# EAGLE design small (EAGLE 5.11)

## Sheet 1 of 3
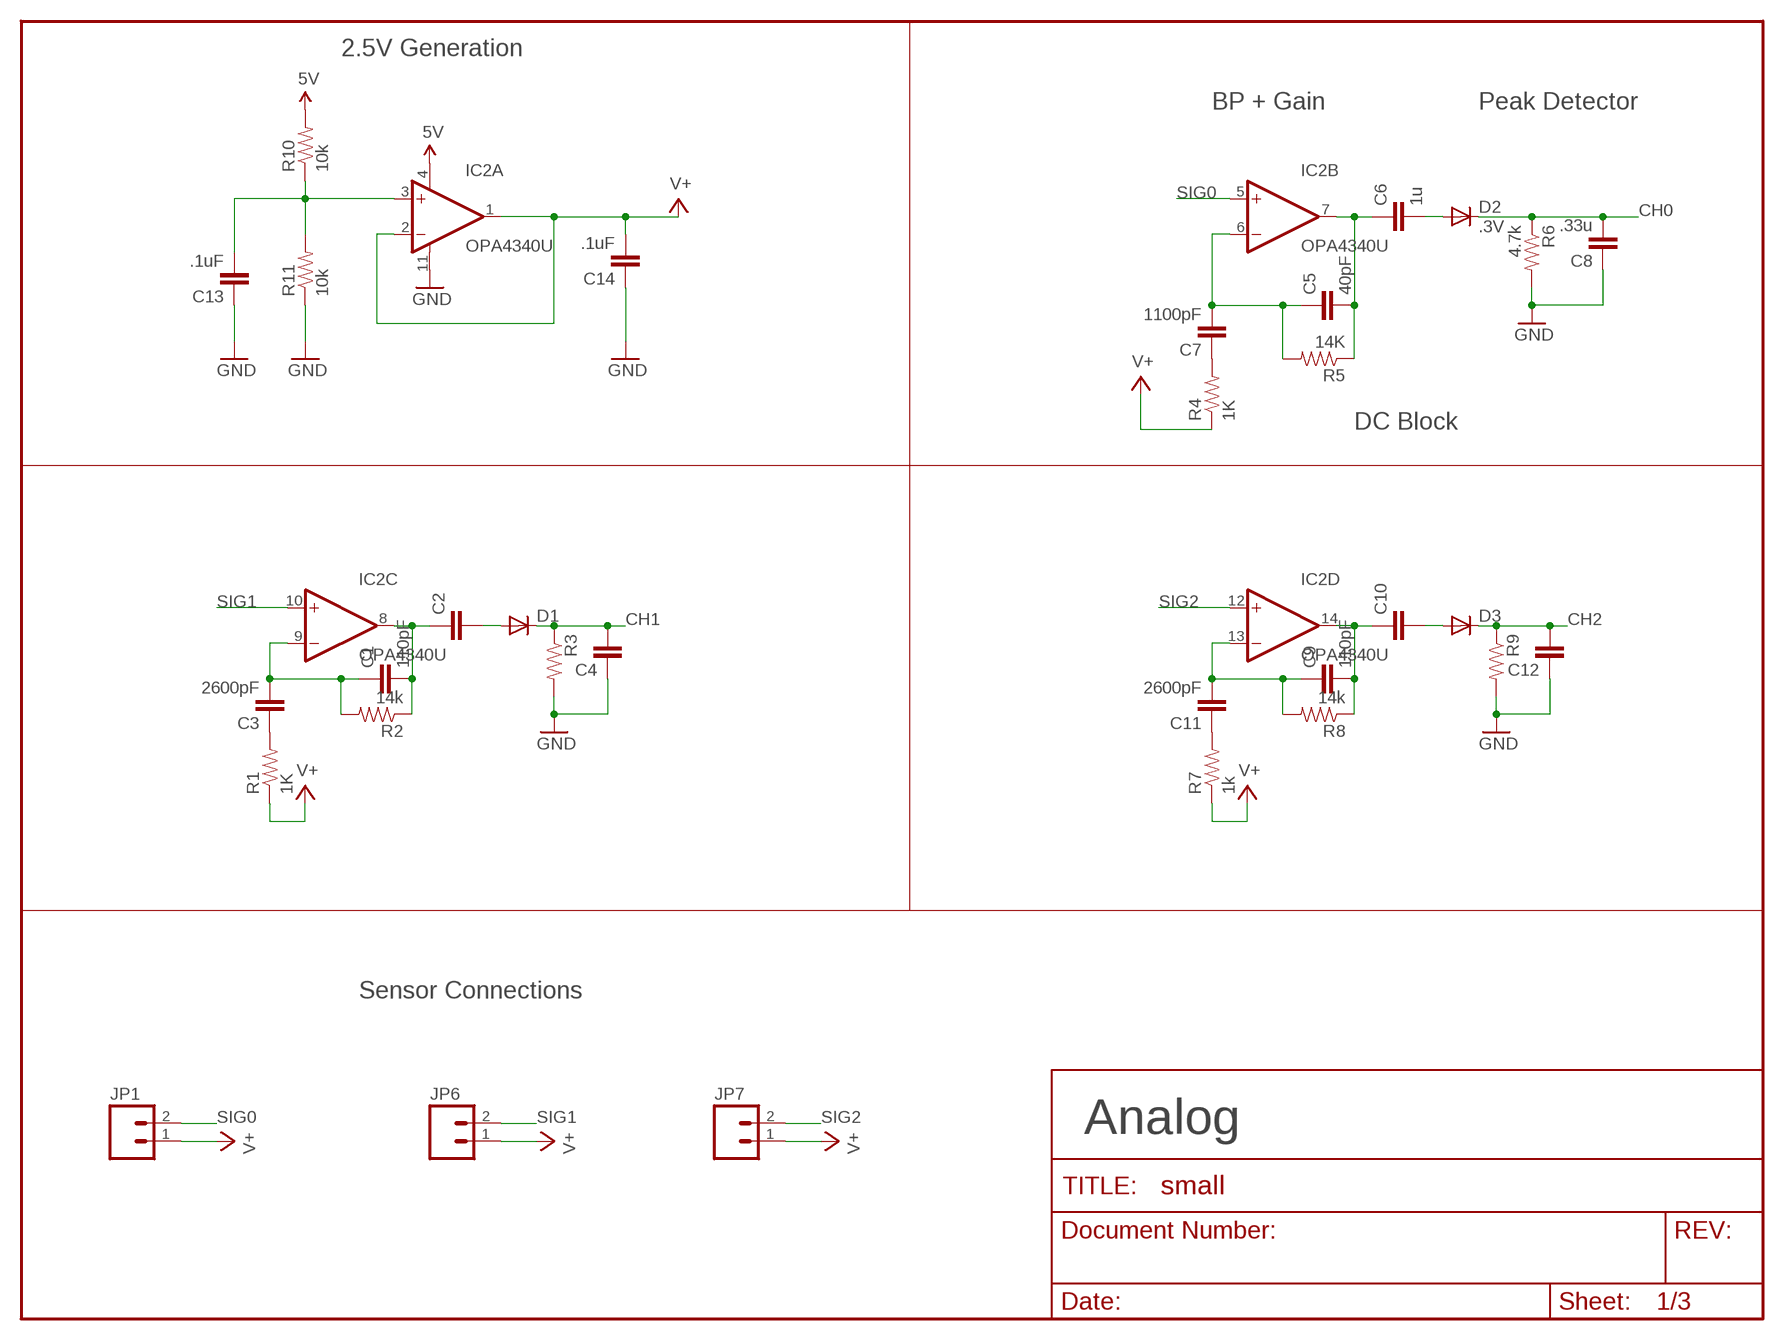
[diagram p0: schematic, sheet 1]

### Parts
C1  110pF  CAP0603-CAP  [0603-CAP]
C2  CAP0603-CAP  [0603-CAP]
C3  2600pF  CAP0603-CAP  [0603-CAP]
C4  CAP0603-CAP  [0603-CAP]
C5  40pF  CAP0603-CAP  [0603-CAP]
C6  1u  CAP0603-CAP  [0603-CAP]
C7  1100pF  CAP0603-CAP  [0603-CAP]
C8  .33u  CAP0603-CAP  [0603-CAP]
C9  110pF  CAP0603-CAP  [0603-CAP]
C10  CAP0603-CAP  [0603-CAP]
C11  2600pF  CAP0603-CAP  [0603-CAP]
C12  CAP0603-CAP  [0603-CAP]
C13  .1uF  CAP0603-CAP  [0603-CAP]
C14  .1uF  CAP0603-CAP  [0603-CAP]
D1  DIODESOD  [SOD-323]
D2  .3V  DIODESOD  [SOD-323]
D3  DIODESOD  [SOD-323]
IC2  OPA4340U  [SO14]
JP1  M02POLAR  [MOLEX-1X2]
JP6  M02POLAR  [MOLEX-1X2]
JP7  M02POLAR  [MOLEX-1X2]
R1  1K  RESISTOR0603-RES  [0603-RES]
R2  14k  RESISTOR0603-RES  [0603-RES]
R3  RESISTOR0603-RES  [0603-RES]
R4  1K  RESISTOR0603-RES  [0603-RES]
R5  14K  RESISTOR0603-RES  [0603-RES]
R6  4.7k  RESISTOR0603-RES  [0603-RES]
R7  1k  RESISTOR0603-RES  [0603-RES]
R8  14k  RESISTOR0603-RES  [0603-RES]
R9  RESISTOR0603-RES  [0603-RES]
R10  10k  RESISTOR0603-RES  [0603-RES]
R11  10k  RESISTOR0603-RES  [0603-RES]

### Nets
5V: IC2.4(A:V+) R10.2 ; also sheet 2,3
CH0: C8.2 D2.1(C) R6.1 ; also sheet 3
CH1: C4.2 D1.1(C) R3.1 ; also sheet 3
CH2: C12.2 D3.1(C) R9.1 ; also sheet 3
GND: C4.1 C8.1 C12.1 C13.1 C14.1 IC2.11(A:V-) R3.2 R6.2 R9.2 R11.1 ; also sheet 2,3
N$1: C2.2 D1.2(A)
N$2: C1.1 C3.2 IC2.9(C:-IN) R2.2
N$3: C3.1 R1.2
N$4: C6.2 D2.2(A)
N$5: C1.2 C2.1 IC2.8(C:OUT) R2.1
N$6: C5.1 C7.2 IC2.6(B:-IN) R5.2
N$8: C7.1 R4.2
N$9: C5.2 C6.1 IC2.7(B:OUT) R5.1
N$11: C10.2 D3.2(A)
N$12: C9.1 C11.2 IC2.13(D:-IN) R8.2
N$13: C11.1 R7.2
N$14: C9.2 C10.1 IC2.14(D:OUT) R8.1
N$17: C13.2 IC2.3(A:+IN) R10.1 R11.2
SIG0: IC2.5(B:+IN) JP1.2
SIG1: IC2.10(C:+IN) JP6.2
SIG2: IC2.12(D:+IN) JP7.2
V+: C14.2 IC2.1(A:OUT) IC2.2(A:-IN) JP1.1 JP6.1 JP7.1 R1.1 R4.1 R7.1 ; also sheet 3

### Notes on the sheet
- 2.5V Generation
- BP + Gain | Peak Detector
- DC Block
- Sensor Connections
- Analog

## Sheet 2 of 3
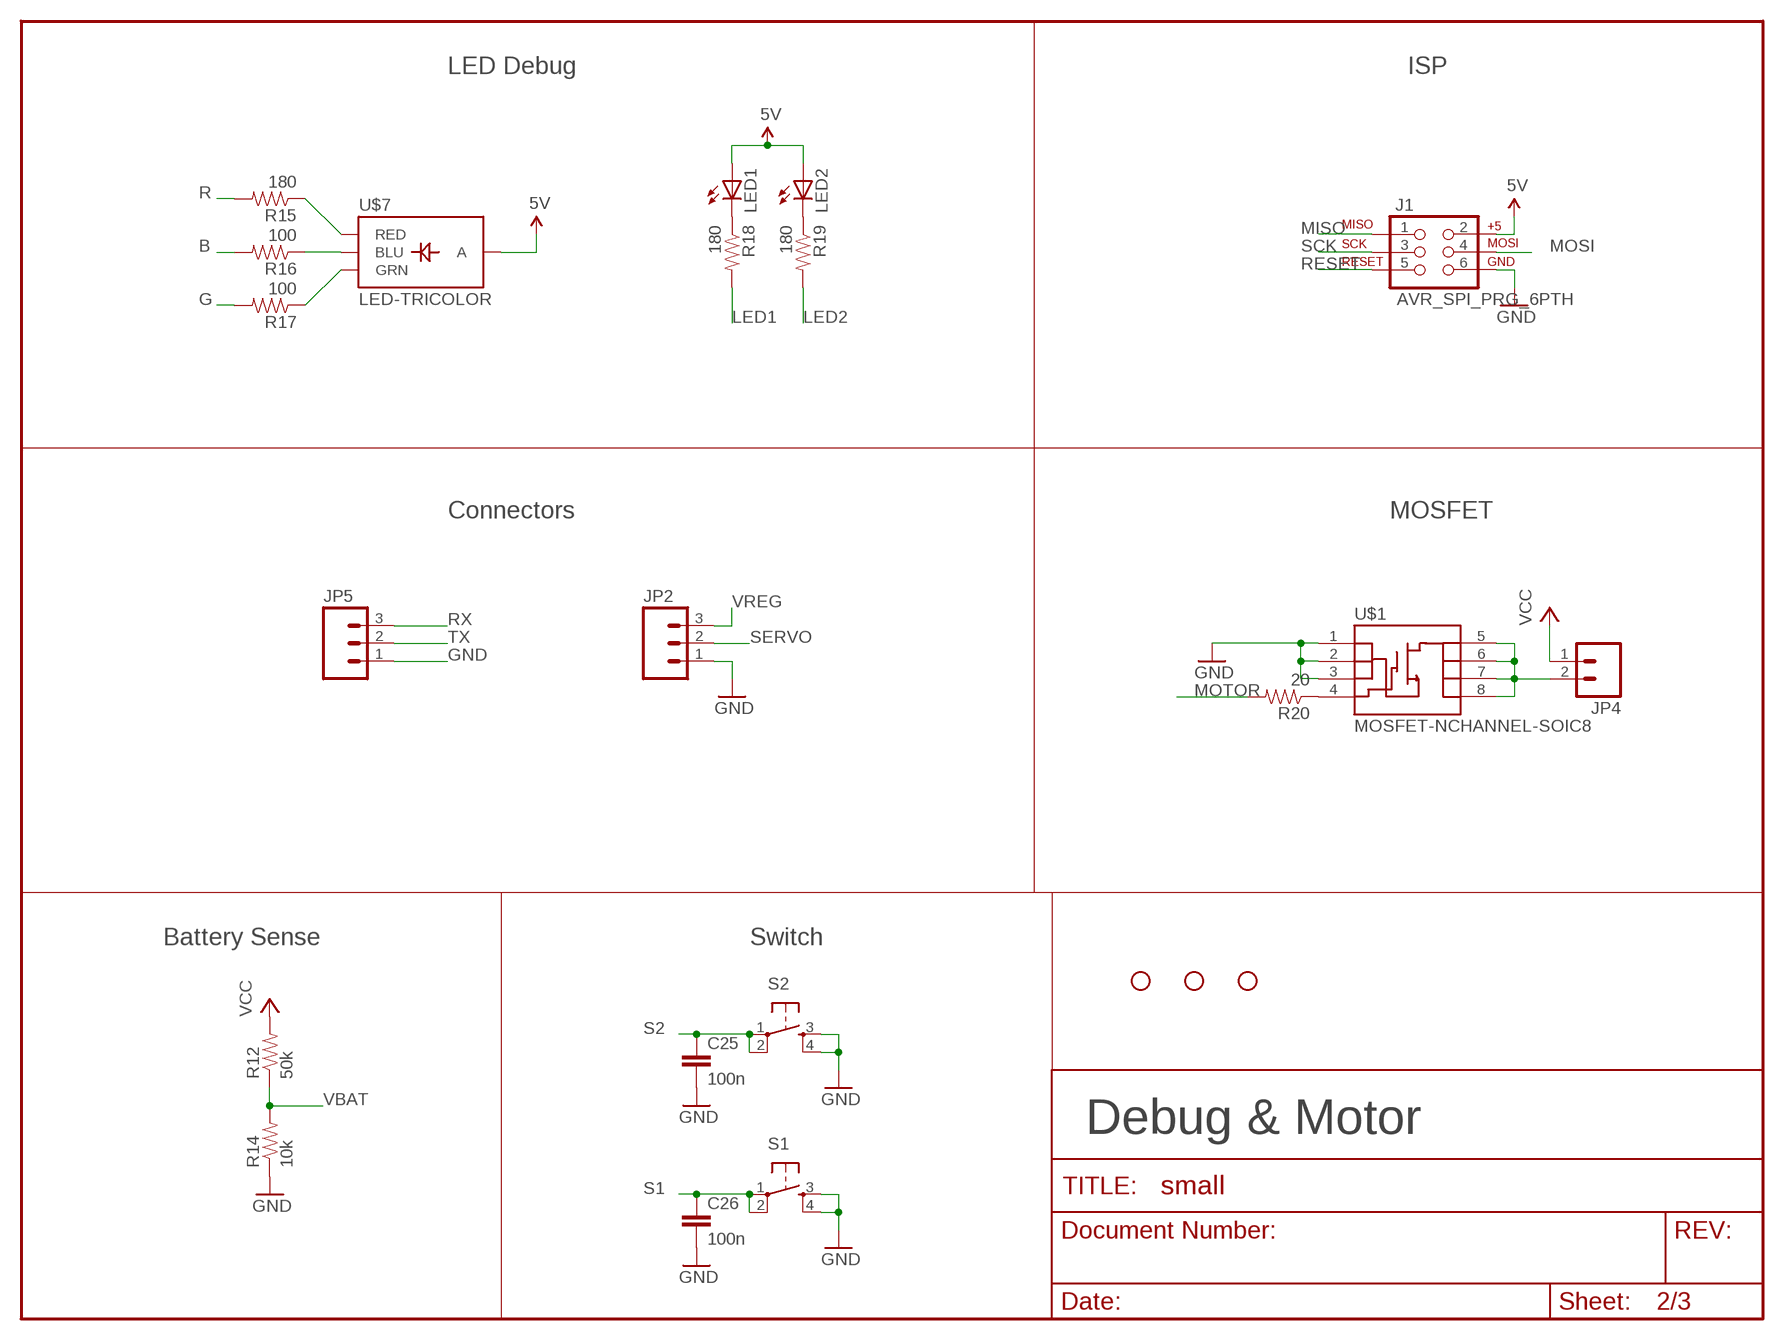
[diagram p1: schematic, sheet 2]

### Parts
C25  100n  CAP0603-CAP  [0603-CAP]
C26  100n  CAP0603-CAP  [0603-CAP]
J1  AVR_SPI_PRG_6PTH  [2X3]
JP2  M03PTH  [1X03]
JP4  M02PTH  [1X02]
JP5  M03PTH  [1X03]
JP8  STAND-OFF  [STAND-OFF]
JP9  STAND-OFF  [STAND-OFF]
JP10  STAND-OFF  [STAND-OFF]
LED1  LED0603  [LED-0603]
LED2  LED0603  [LED-0603]
R12  50k  RESISTOR0603-RES  [0603-RES]
R14  10k  RESISTOR0603-RES  [0603-RES]
R15  180  RESISTOR0603-RES  [0603-RES]
R16  100  RESISTOR0603-RES  [0603-RES]
R17  100  RESISTOR0603-RES  [0603-RES]
R18  180  RESISTOR0603-RES  [0603-RES]
R19  180  RESISTOR0603-RES  [0603-RES]
R20  20  RESISTOR0603-RES  [0603-RES]
S1  TAC_SWITCHSMD  [TACTILE_SWITCH_SMD]
S2  TAC_SWITCHSMD  [TACTILE_SWITCH_SMD]
U$1  MOSFET-NCHANNEL-SOIC8  [SO08]
U$7  LED-TRICOLOR  [LED-TRICOLOR-SMD]

### Nets
5V: J1.2 LED1.A LED2.A U$7.A ; also sheet 1,3
B: R16.2 ; also sheet 3
G: R17.2 ; also sheet 3
GND: C25.2 C26.2 J1.6 JP2.1 JP5.1 R14.1 S1.3 S1.4 S2.3 S2.4 U$1.1(S) U$1.2(S) U$1.3(S) ; also sheet 1,3
LED1: R18.2 ; also sheet 3
LED2: R19.2 ; also sheet 3
MISO: J1.1 ; also sheet 3
MOSI: J1.4 ; also sheet 3
MOTOR: R20.2 ; also sheet 3
N$10: LED1.C R18.1
N$16: LED2.C R19.1
N$18: R20.1 U$1.4(G)
N$19: R15.1 U$7.R(RED)
N$20: R16.1 U$7.B(BLU)
N$21: JP4.2 U$1.5(D) U$1.6(D) U$1.7(D) U$1.8(D)
N$22: R17.1 U$7.G(GRN)
R: R15.2 ; also sheet 3
RESET: J1.5 ; also sheet 3
RX: JP5.3 ; also sheet 3
S1: C26.1 S1.1 S1.2 ; also sheet 3
S2: C25.1 S2.1 S2.2 ; also sheet 3
SCK: J1.3 ; also sheet 3
SERVO: JP2.2 ; also sheet 3
TX: JP5.2 ; also sheet 3
VBAT: R12.1 R14.2 ; also sheet 3
VCC: JP4.1 R12.2 ; also sheet 3
VREG: JP2.3 ; also sheet 3

### Notes on the sheet
- LED Debug | ISP
- Connectors | MOSFET
- Battery Sense | Switch
- Debug & Motor

## Sheet 3 of 3
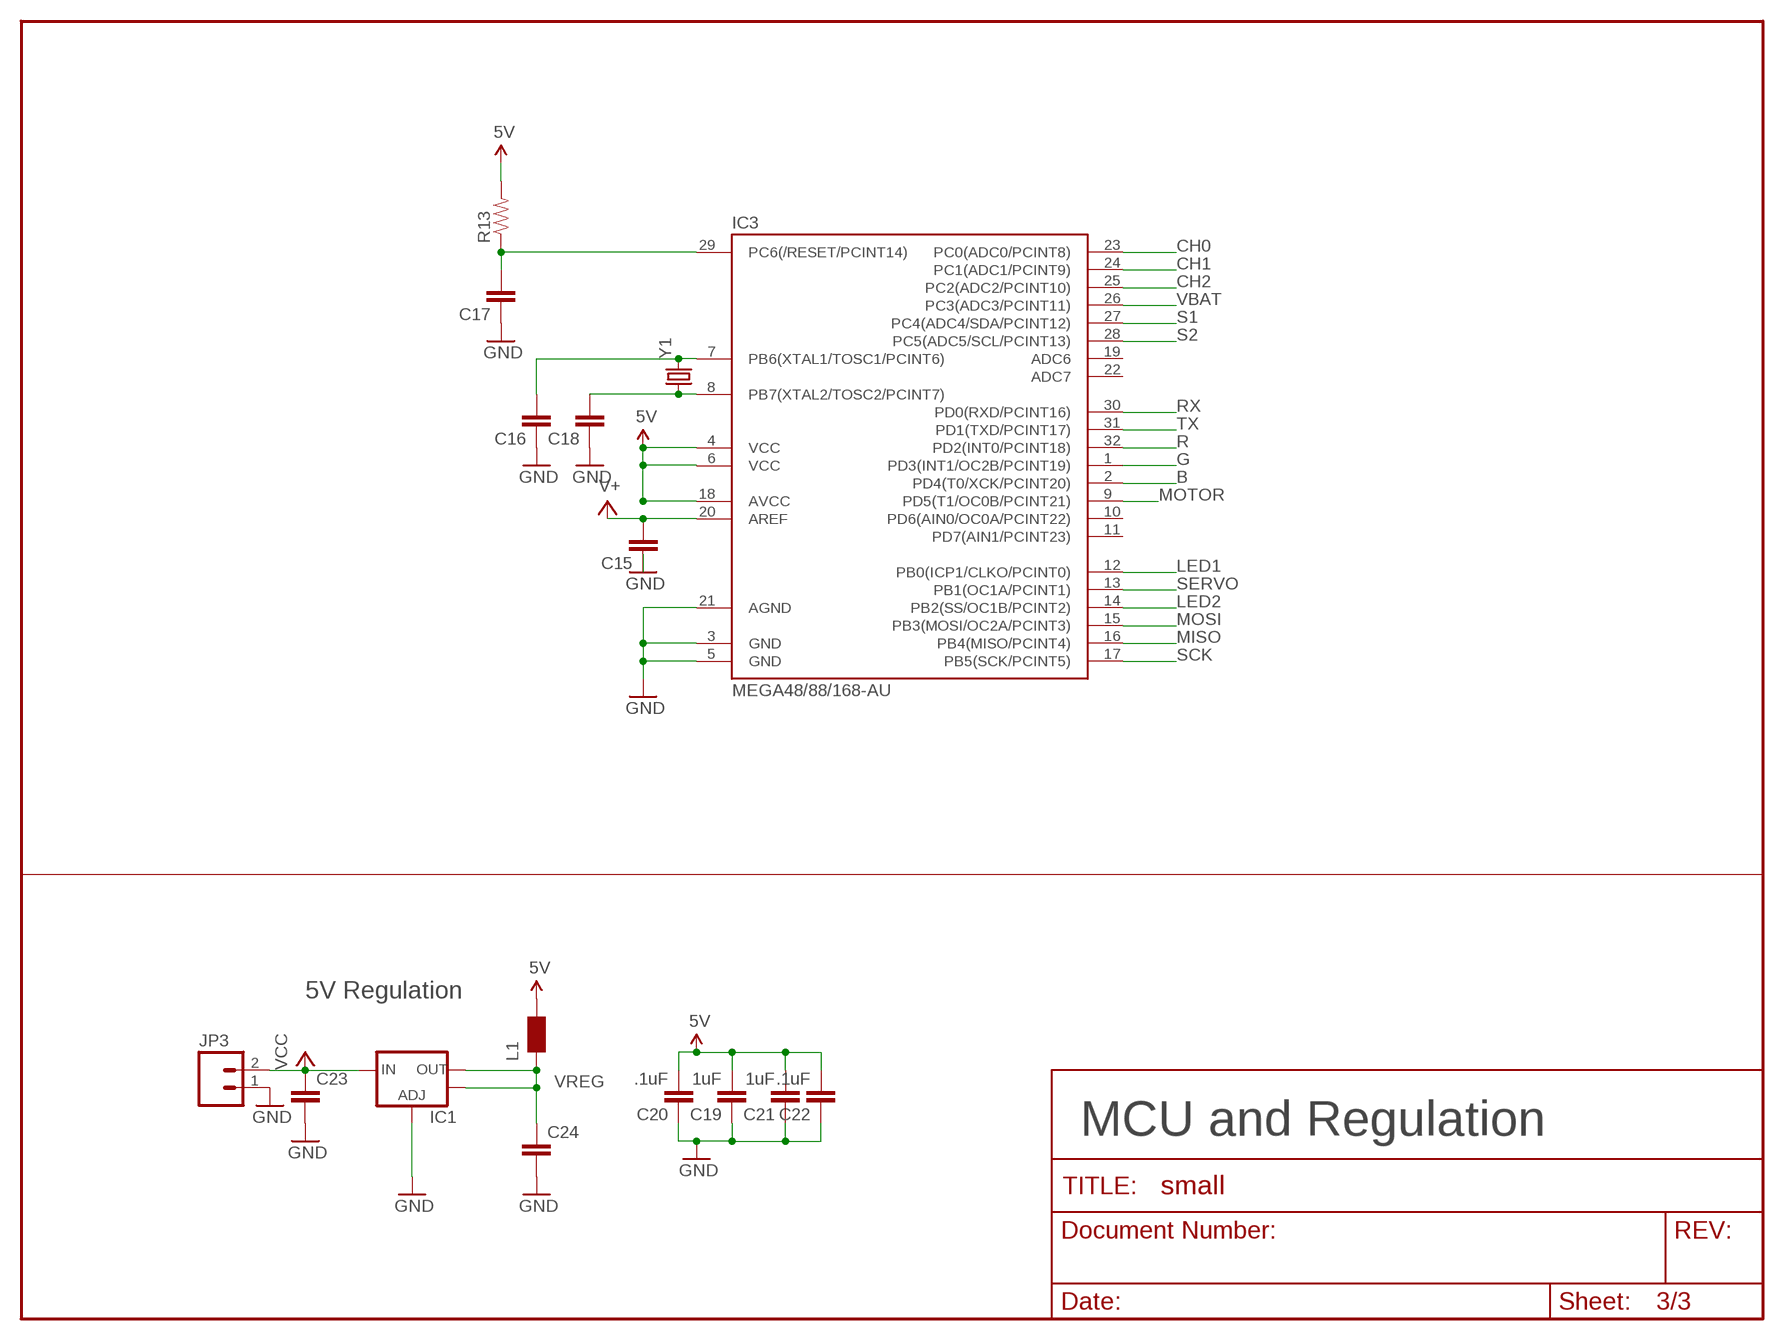
[diagram p2: schematic, sheet 3]

### Parts
C15  CAP0603-CAP  [0603-CAP]
C16  CAP0603-CAP  [0603-CAP]
C17  CAP0603-CAP  [0603-CAP]
C18  CAP0603-CAP  [0603-CAP]
C19  1uF  CAP0603-CAP  [0603-CAP]
C20  .1uF  CAP0603-CAP  [0603-CAP]
C21  1uF  CAP0603-CAP  [0603-CAP]
C22  .1uF  CAP0603-CAP  [0603-CAP]
C23  CAP1206  [1206]
C24  CAP1206  [1206]
IC1  V_REG_LM1117SOT223  [SOT223]
IC3  MEGA48/88/168-AU  [TQFP32-08]
JP3  M02PTH  [1X02]
L1  WE-CBF_0805  [0805]
R13  RESISTOR0603-RES  [0603-RES]
Y1  CRYSTAL5X3  [CRYSTAL-SMD-5X3]

### Nets
5V: C19.2 C20.2 C21.2 C22.2 IC3.4(VCC) IC3.6(VCC) IC3.18(AVCC) L1.2 R13.2 ; also sheet 1,2
B: IC3.2(PD4(T0/XCK/PCINT20)) ; also sheet 2
CH0: IC3.23(PC0(ADC0/PCINT8)) ; also sheet 1
CH1: IC3.24(PC1(ADC1/PCINT9)) ; also sheet 1
CH2: IC3.25(PC2(ADC2/PCINT10)) ; also sheet 1
G: IC3.1(PD3(INT1/OC2B/PCINT19)) ; also sheet 2
GND: C15.1 C16.1 C17.1 C18.1 C19.1 C20.1 C21.1 C22.1 C23.2 C24.2 IC1.1(ADJ) IC3.3(GND) IC3.5(GND) IC3.21(AGND) JP3.1 ; also sheet 1,2
LED1: IC3.12(PB0(ICP1/CLKO/PCINT0)) ; also sheet 2
LED2: IC3.14(PB2(SS/OC1B/PCINT2)) ; also sheet 2
MISO: IC3.16(PB4(MISO/PCINT4)) ; also sheet 2
MOSI: IC3.15(PB3(MOSI/OC2A/PCINT3)) ; also sheet 2
MOTOR: IC3.9(PD5(T1/OC0B/PCINT21)) ; also sheet 2
N$7: C16.2 IC3.7(PB6(XTAL1/TOSC1/PCINT6)) Y1.3
N$15: C18.2 IC3.8(PB7(XTAL2/TOSC2/PCINT7)) Y1.1
R: IC3.32(PD2(INT0/PCINT18)) ; also sheet 2
RESET: C17.2 IC3.29(PC6(/RESET/PCINT14)) R13.1 ; also sheet 2
RX: IC3.30(PD0(RXD/PCINT16)) ; also sheet 2
S1: IC3.27(PC4(ADC4/SDA/PCINT12)) ; also sheet 2
S2: IC3.28(PC5(ADC5/SCL/PCINT13)) ; also sheet 2
SCK: IC3.17(PB5(SCK/PCINT5)) ; also sheet 2
SERVO: IC3.13(PB1(OC1A/PCINT1)) ; also sheet 2
TX: IC3.31(PD1(TXD/PCINT17)) ; also sheet 2
V+: C15.2 IC3.20(AREF) ; also sheet 1
VBAT: IC3.26(PC3(ADC3/PCINT11)) ; also sheet 2
VCC: C23.1 IC1.3(IN) JP3.2 ; also sheet 2
VREG: C24.1 IC1.2(OUT) IC1.4(OUT) L1.1 ; also sheet 2
Unconnected: IC3.10(PD6(AIN0/OC0A/PCINT22)) IC3.11(PD7(AIN1/PCINT23)) IC3.19(ADC6) IC3.22(ADC7)

### Notes on the sheet
- 5V Regulation
- MCU and Regulation

## Library data of the parts
C1-C26 = SparkFun:CAP: Capacitor Standard 0603 ceramic capacitor, and 0.1" leaded capacitor.
D1-D3 = SparkFun:DIODE: Diode These are standard reverse protection diodes and small signal diodes. SMA package can handle up to about 1A. SOD-323 can handle about 200mA. What the SOD-323 package when ordering, there are some mfgs out there that are 5-pin packages.
IC1 = SparkFun:V_REG_LM1117: Voltage Regulator LM1117 Standard adjustable voltage regulator but in SMD form. Spark Fun Electronics SKU : COM-00595
IC2 = burr-brown:OPA4340: Operational Amplifiers Source: http://focus.ti.com/lit/ds/sbos073/sbos073.pdf; MF: TEXAS INSTRUMENTS; MPN: OPA4340UA; OC_FARNELL: 1212307; OC_NEWARK: 35C1907
IC3 = avr-7:MEGA48/88/168
J1 = SparkFun:AVR_SPI_PRG_6: AVR ISP 6 Pin This is the reduced ISP connector for AVR programming. Common on Arduino. This footprint will take up less PCB space and can be used with a 10-pin to 6-pin adapter such as SKU: BOB-08508
JP1 JP3 JP4 JP6 JP7 = SparkFun:M02: Header 2 Standard 2-pin 0.1" header. Use with straight break away headers (SKU : PRT-00116), right angle break away headers (PRT-00553), swiss pins (PRT-00743), machine pins (PRT-00117), and female headers (PRT-00115). Molex polarized connector foot print use with SKU : PRT-08233 with associated crimp pins and housings.
JP2 JP5 = SparkFun:M03: Header 3 Standard 3-pin 0.1" header. Use with straight break away headers (SKU : PRT-00116), right angle break away headers (PRT-00553), swiss pins (PRT-00743), machine pins (PRT-00117), and female headers (PRT-00115). Molex polarized connector foot print use with SKU : PRT-08232 with associated crimp pins and housings.
JP8-JP10 = SparkFun:STAND-OFF: Stand Off This is the mechanical footprint for a #4 phillips button head screw. Use the keepout ring to avoid running the screw head into surrounding components. SKU : PRT-00447
L1 = wuerth-elektronik:WE-CBF: SMD EMI Suppression Ferrite Beads - excellent anti-EMI properties - low DCR - impedances till 3000 ohms - rated current up to 6 A
LED1 LED2 = SparkFun:LED: LEDs Standard schematic elements and footprints for 5mm, 3mm, 1206, and 0603 sized LEDs. 5mm - Spark Fun Electronics SKU : COM-00529 (and others)
R1-R20 = SparkFun:RESISTOR: Resistor Basic schematic elements and footprints for 0603, 1206, and PTH resistors.
S1 S2 = SparkFun:TAC_SWITCH: Momentary Switch Button commonly used for reset or general input. Spark Fun Electronics SKU : COM-00097
U$1 = SparkFun:MOSFET-NCHANNEL-SOIC8: N-Channel MOSFET IRF9410 and NDS8434 are common, SOIC-8 parts.
U$7 = SparkFun:LED-TRICOLOR: Tri-Color LED SMD Proven layout and schematic for triple color LED in SMD package - common anode. Spark Fun Electronics SKU : COM-07844
Y1 = SparkFun:CRYSTAL: Crystals Various standard crystals. Proven footprints. Spark Fun Electronics SKU : COM-00534

## Board
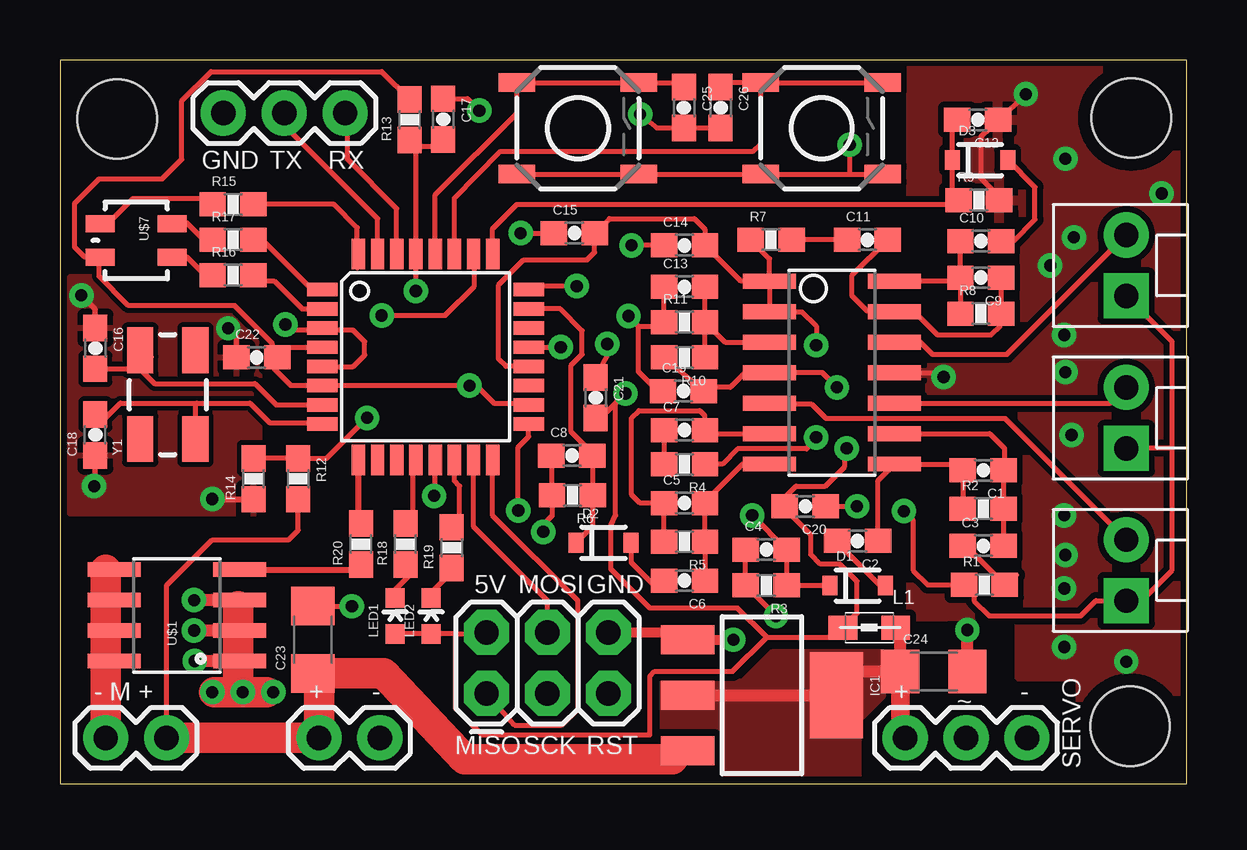
[diagram p3: board, top side]
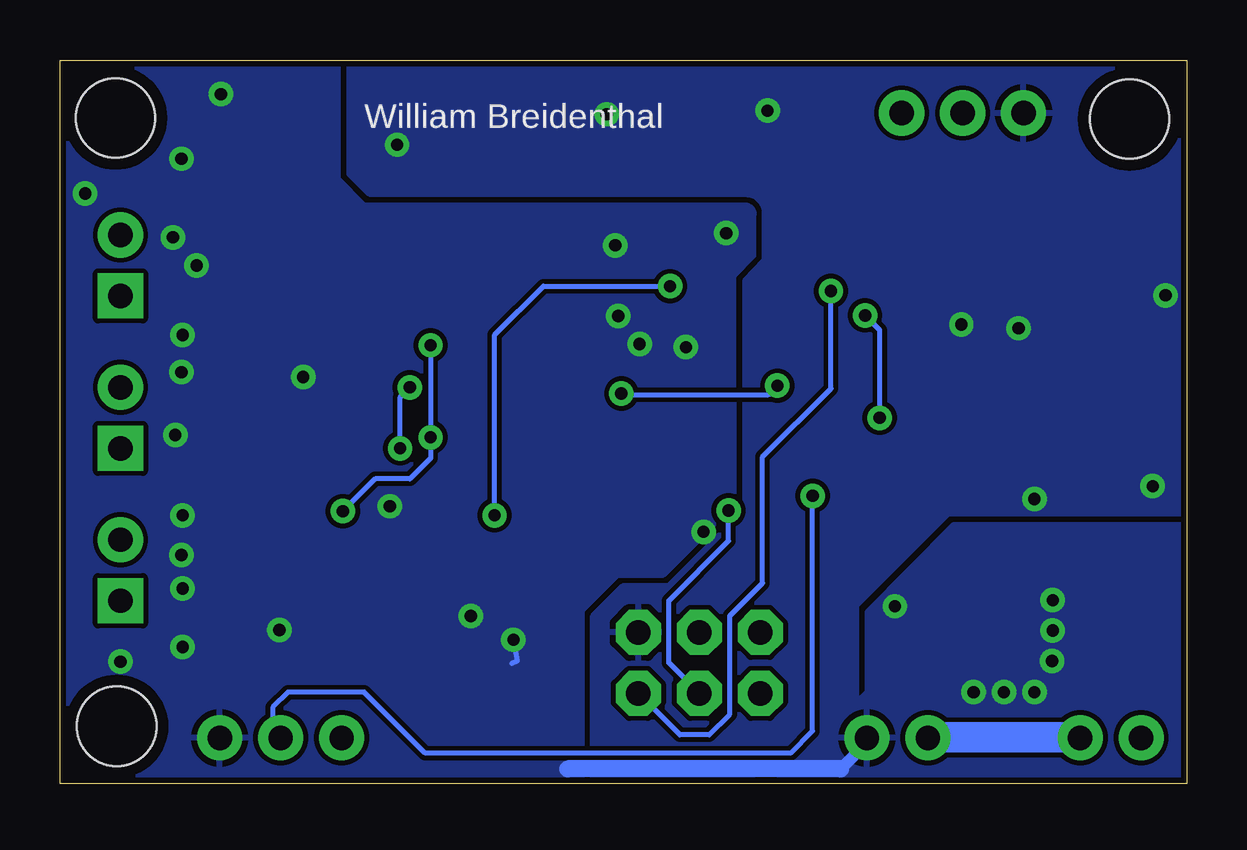
[diagram p4: board, bottom side, seen from below]

Size 46.97 x 30.15 mm. Coordinates in mm from the lower left corner, seen from the top.
Outline: 0,0 46.97,0 46.97,30.15 0,30.15 0,0
Copper layers (1*16): Top 0.035mm / dielectric 1.5mm / Bottom 0.035mm
Design rules "SparkFun": minimum track width 8mil, minimum drill 20mil, track to track 8mil, track to pad 8mil, pad to pad 8mil, via to via 8mil, smd to smd 8mil, copper to edge 10mil, drill to drill 8mil, minimum pad ring 12mil, minimum via ring 10mil, stop-mask expansion 4mil, vias tented up to drill 25mil, thermal gap 10mil

### Footprints (pad centres in the part's own frame; a part is rotated, then mirrored left to right if it is on the bottom)
0603-CAP = smd 1.1 x 1: 1 -0.85,0; 2 0.85,0
1206 = smd 1.6 x 1.8: 1 -1.4,0; 2 1.4,0
SOD-323 = smd 0.63 x 0.83: 1 -1.15,0; 2 1.15,0
SOT223 = smd 1.219 x 2.235: 1 -2.311,-3.099; 2 0,-3.099; 3 2.311,-3.099 | smd 3.6 x 2.2: 4 0,3.099
SO14 = smd 0.61 x 2.21: 1 -3.81,-2.603; 2 -2.54,-2.603; 3 -1.27,-2.603; 4 0,-2.603; 5 1.27,-2.603; 6 2.54,-2.603; 7 3.81,-2.603; 8 3.81,2.603; 9 2.54,2.603; 10 1.27,2.603; 11 0,2.603; 12 -1.27,2.603; 13 -2.54,2.603; 14 -3.81,2.603
TQFP32-08 = smd 1.27 x 0.559: 1 -4.293,2.8; 2 -4.293,2; 3 -4.293,1.2; 4 -4.293,0.4; 5 -4.293,-0.4; 6 -4.293,-1.2; 7 -4.293,-2; 8 -4.293,-2.8; 17 4.293,-2.8; 18 4.293,-2; 19 4.293,-1.2; 20 4.293,-0.4; 21 4.293,0.4; 22 4.293,1.2; 23 4.293,2; 24 4.293,2.8 | smd 0.559 x 1.27: 9 -2.8,-4.293; 10 -2,-4.293; 11 -1.2,-4.293; 12 -0.4,-4.293; 13 0.4,-4.293; 14 1.2,-4.293; 15 2,-4.293; 16 2.8,-4.293; 25 2.8,4.293; 26 2,4.293; 27 1.2,4.293; 28 0.4,4.293; 29 -0.4,4.293; 30 -1.2,4.293; 31 -2,4.293; 32 -2.8,4.293
2X3 = drill 1.016 pad 1.88 octagon: 1 0,0; 2 0,2.54; 3 2.54,0; 4 2.54,2.54; 5 5.08,0; 6 5.08,2.54
MOLEX-1X2 = drill 1.016 pad 1.88 square: 1 0,0 | drill 1.016 pad 1.88 round: 2 2.54,0
1X03 = drill 1.016 pad 1.88 round: 1 0,0; 2 2.54,0; 3 5.08,0
1X02 = drill 1.016 pad 1.88 round: 1 0,0; 2 2.54,0
STAND-OFF = hole 3.302: 0,0
0805 = smd 1.2 x 1: 1 -1.1,0; 2 1.1,0
LED-0603 = smd 0.8 x 0.8: A 0,-0.75; C 0,0.75
0603-RES = smd 1.1 x 1: 1 -0.85,0; 2 0.85,0
TACTILE_SWITCH_SMD = smd 1.524 x 0.762: 1 -2.54,1.905; 2 2.54,1.905; 3 -2.54,-1.905; 4 2.54,-1.905
SO08 = smd 0.61 x 2.21: 1 -1.905,-2.616; 2 -0.635,-2.616; 3 0.635,-2.616; 4 1.905,-2.616; 5 1.905,2.616; 6 0.635,2.616; 7 -0.635,2.616; 8 -1.905,2.616
LED-TRICOLOR-SMD = smd 0.7 x 1.2: A 0.7,-1.5; B 0.7,1.5; G -0.7,1.5; R -0.7,-1.5
CRYSTAL-SMD-5X3 = smd 1.9 x 1.1: 1 -1.85,-1.15; 2 1.85,-1.15; 3 1.85,1.15; 4 -1.85,1.15

### Placement (x,y rotation side)
C1  38.48,13.06 180 top
C2  33.25,10.11 180 top
C3  38.48,9.91 0 top
C4  29.44,9.75 0 top
C5  110pF  [0603-CAP]  26.04,11.68 0 top
C6  [0603-CAP]  26.04,8.46 180 top
C7  2600pF  [0603-CAP]  26.04,14.73 0 top
C8  21.34,13.67 0 top
C9  38.38,21.08 180 top
C10  38.38,22.61 0 top
C11  33.66,22.66 0 top
C12  38.25,27.66 180 top
C13  26.04,20.7 0 top
C14  26.04,22.43 0 top
C15  21.44,22.94 0 top
C16  1.47,18.14 270 top
C17  15.98,27.69 270 top
C18  1.47,14.53 90 top
C19  25.98,16.36 0 top
C20  31.06,11.56 180 top
C21  22.33,16.08 270 top
C22  8.2,17.75 0 top
C23  10.54,5.99 90 top
C24  36.42,4.67 0 top
C25  26.01,28.17 270 top
C26  27.53,28.17 270 top
D1  33.25,8.26 0 top
D2  22.66,10.03 0 top
D3  38.35,25.98 0 top
IC1  29.26,3.68 270 top
IC2  32.18,17.12 270 top
IC3  15.24,17.78 0 top
J1  17.78,3.76 0 top
JP1  44.45,7.62 90 top
JP2  40.31,1.91 180 top
JP3  13.34,1.91 180 top
JP4  4.45,1.91 180 top
JP5  6.81,27.94 0 top
JP6  44.45,13.97 90 top
JP7  44.45,20.32 90 top
JP8  44.6,2.39 0 top
JP9  44.65,27.74 0 top
JP10  2.39,27.69 0 top
L1  33.73,6.5 180 top
LED1  13.97,6.99 0 top
LED2  15.47,6.99 0 top
R1  38.53,8.28 0 top
R2  38.48,11.46 0 top
R3  29.44,8.26 180 top
R4  26.04,13.31 180 top
R5  26.04,10.08 180 top
R6  21.36,12.01 180 top
R7  29.64,22.66 0 top
R8  38.38,19.58 0 top
R9  38.3,24.31 0 top
R10  26.04,17.75 180 top
R11  26.04,19.23 0 top
R12  9.93,12.7 270 top
R13  14.58,27.66 90 top
R14  8.08,12.7 90 top
R15  7.21,24.13 0 top
R16  7.21,21.18 0 top
R17  7.21,22.66 0 top
R18  14.4,9.98 90 top
R19  16.33,9.83 90 top
R20  12.55,9.98 90 top
S1  31.75,27.3 0 top
S2  21.59,27.3 0 top
U$1  4.88,7.01 90 top
U$7  3.17,22.63 270 top
Y1  4.5,16.21 90 top

### Tracks (layer width: path | path; a pad name or v marks a point on that pad's centre or on a via)
5V  (via drill 0.51)
  Top 0.203: IC3.4 9.2,18.18 C22.2 | C22.2 8.83,18.38 7.29,19.91 2.85,19.91 1.63,21.13 1.63,21.88 U$7.A 1.66,21.95 1.02,21.95 0.61,22.35 0.61,24.18 1.63,25.2 4.27,25.2 5.08,26.01 5.08,28.45 6.3,29.67 13.41,29.67 14.57,28.51 R13.2 | C22.2 8.94,17.92 8.94,17.27 9.63,16.58 IC3.6 v17.07,16.58 17.35,16.58 18.09,15.85 19.46,15.85 IC3.18 | v32.38,16.51 31.77,17.12 IC2.4 28.55,17.12 27.94,16.51 26.99,16.51 C19.2 26.61,16.51 R10.2 | 32.79,13.93 v32.79,13.97 32.72,13.89 32.72,13.21 31.9,12.39 30.68,12.39 30.21,11.93 C20.2 30.34,11.43 30.48,11.43 30.48,11.18 31.29,10.36 31.29,9.55 31.7,9.14 32.51,9.14 33.22,8.43 33.22,7.09 L1.2 32.23,6.1 29.46,6.1 | LED1.A LED2.A 16.51,6.24 | 16.51,6.24 17.72,6.24 J1.2 | 16.51,6.24 16.48,6.21 16.48,3.15 17.6,2.03 24.59,2.03 24.59,4.47 24.79,4.67 28.04,4.67 29.46,6.1 | C21.2 22.19,15.47 22.79,15.47 v23.57,16.26 23.16,15.85 23.16,11.18 22.96,10.77 22.96,8.94 24.59,7.32 28.25,7.32 29.46,6.1
  Bottom 0.203: v32.79,13.97 32.79,16.1 v32.38,16.51 | v17.07,16.58 17.44,16.2 23.52,16.2 v23.57,16.26
B
  Top 0.203: IC3.2 10.09,19.78 8.94,20.93 8.32,20.93 R16.2
CH0
  Top 0.203: C8.2 22.26,13.59 | IC3.23 20.86,19.78 21.77,18.87 21.77,17.88 21.31,17.42 21.31,14.66 22.19,13.78 C8.2 | C8.2 22.06,13.54 | C8.2 22.21,13.64 R6.1 22.23,11.95 22.23,10.75 D2.1
CH1  (via drill 0.51)
  Top 0.203: D1.1 R3.1 C4.2 30.28,9.75 v28.85,11.18 | v21.54,20.73 19.68,20.73 IC3.24
  Bottom 0.203: v28.85,11.18 28.85,18.69 26.82,20.73 v21.54,20.73
CH2
  Top 0.203: C12.2 37.2,27.46 D3.1 37.2,24.56 R9.1 37.27,24.13 19.05,24.13 18.04,23.12 IC3.25
G
  Top 0.203: 8.27,22.86 R17.2 8.16,22.55 8.53,22.55 10.51,20.58 IC3.1
GND  (via drill 0.51)
  Top 0.203: C23.2 11.91,7.39 v12.17,7.39 | 11.03,18.9 IC3.3 | C17.1 16.98,28.54 v17.48,28.04 | S2.3 S2.4 S1.3 32.92,25.4 | 32.92,25.4 S1.4 | v19.2,22.94 C15.1 | C14.1 v23.82,22.43 | IC2.11 36.8,17.12 v36.83,16.94 | R9.2 39.15,24.45 38.41,25.2 38.41,26.96 | 38.41,26.96 C12.1 | 38.41,26.96 38.41,26.98 v40.26,28.73 | 28.57,8.26 R3.2 | 28.57,8.26 28.57,9.74 C4.1 | v29.84,6.99 28.57,8.26 | C20.1 v33.22,11.56 | C21.1 22.84,17.88 v22.81,18.31 | 20.36,13.54 C8.1 20.51,13.64 R6.2 20.52,12 20.52,11.18 20.14,10.79 v20.14,10.49 | C19.1 24.92,16.36 24.11,17.17 24.11,19.05 | C13.1 R11.1 25.01,19.05 24.11,19.05 | 24.11,19.05 v23.7,19.48 | 11.03,18.9 12.22,18.9 12.7,18.41 12.7,17.86 12.22,17.37 IC3.5 | 11.03,18.9 9.63,18.9 v9.4,19.13 | C22.1 7.35,18.63 v7.01,18.97 | C16.1 1.47,19.76 v0.89,20.34 | C18.1 1.47,12.55 v1.42,12.39 | IC3.21 19.97,18.18 v20.88,18.19 | 32.92,25.4 v32.92,26.62 | v24.18,27.89 24.88,27.32 C25.2 C26.2 | 25.86,6.3 IC1.1
  Top 0.254: v6.35,11.85 R14.1
  Top 0.406: IC1.1 v28.07,5.99 | v6.35,11.86 v6.35,11.85 | J1.6 25.86,6.3
  Top 0.508: U$1.3 v5.59,7.64 | U$1.2 v5.59,6.38 | U$1.1 v5.61,5.11 | C24.2 v37.82,6.4
  Top 1.27: 7.42,7.39 7.42,4.04 7.62,3.83 | 7.62,3.83 7.64,3.81 | 7.64,3.81 8.61,3.81 | v7.62,3.81 6.43,3.81 | 7.64,3.81 v7.62,3.81 | 7.62,3.83 v7.62,3.81
  Bottom 0.203: v17.48,28.04 17.25,28.04 | v28.07,5.99 27.91,5.11 28.14,5
  Bottom 0.508: 13.21,1.83 14.43,0.61
  Bottom 0.711: 14.43,0.61 25.81,0.61
  other vias: 6.35,3.81 8.89,3.81 41.91,26.04 44.45,5.08 42.16,14.53 41.91,9.53 41.86,18.69 41.91,17.14 41.27,21.59 42.27,22.76 45.92,24.59 41.86,11.18 41.86,8.13 41.86,5.69
  pour Top (isolate 0.254): 35.48,29.79 46.99,29.84 46.99,0 42.55,0 42.55,4.45 40.01,4.45 40.01,6.99 35.48,6.93
  pour Bottom (isolate 0.203): 25.2,0 25.2,7.21 23.72,8.69 21.82,8.69 18.85,11.66 18.87,21.13 18.03,22 18.03,23.72 arc-90 18.42,24.1 34.29,24.1 35.36,25.17 35.36,29.84 46.96,29.84 46.96,0
  pour Bottom (isolate 0.203): 0,11.23 9.96,11.23 13.77,7.42 13.77,1.91 14.61,1.27 17.14,1.27 18.41,0 24.77,0 24.77,6.99 23.5,8.26 21.59,8.26 18.41,11.43 18.41,20.98 17.6,21.82 17.6,23.76 arc-90 18.37,24.54 34.06,24.54 34.92,25.4 34.92,29.84 0,29.84
  pour Bottom (isolate 0.203): 0,0 0,10.79 9.73,10.79 13.34,7.14 13.34,3.81 17.35,0
  pour Top (isolate 0.203): 0.41,11.23 0.41,21.13 4.47,21.13 5.69,19.91 8.33,19.91 8.33,11.23
LED1
  Top 0.203: IC3.12 14.71,13.12 14.71,11.14 R18.2 14.43,10.86
LED2
  Top 0.203: 16.66,10.97 16.37,10.68 R19.2 16.66,11.01 16.66,12.39 16.44,12.62 IC3.14
MISO
  Top 0.203: IC3.16 18.04,11.17 21.59,7.62 21.59,3.1 20.9,2.44 18.95,2.44 J1.1
MOSI
  Top 0.203: IC3.15 17.24,10.7 20.32,7.62 J1.4
MOTOR
  Top 0.254: IC3.9 12.44,10.94 R20.2
N$1
  Top 0.203: C2.2 32.6,9.71 32.8,9.64 34.14,8.31 34.32,8.33 D1.2
N$2
  Top 0.203: IC2.9 38.76,14.58 39.37,13.97 39.37,13.22 C1.1 R2.2 C3.2
N$3
  Top 0.203: 39.87,8.69 R1.2 37.76,9.91 C3.1
N$4
  Top 0.203: D2.2 23.81,9.21 24.77,8.26 24.98,8.26 C6.2
N$5
  Top 0.203: C1.2 37.55,13.34 | C2.1 34.1,12.62 IC2.8 37.58,13.31 C1.2 | C1.2 R2.1
N$6
  Top 0.203: 27.09,14.58 IC2.6 | 27.09,14.58 C7.2 26.87,14.74 26.87,15.34 26.67,15.54 24.13,15.54 23.82,15.24 23.82,12.04 24.18,11.68 C5.1 | C5.1 25.11,11.76 | R5.2 C5.1 | 27.09,14.58 27.03,14.58
N$7
  Top 0.203: C16.2 3.32,17.29 | 3.32,17.29 3.81,17.78 3.77,17.78 Y1.3 | IC3.7 9.01,15.78 8.13,16.66 3.94,16.66 3.32,17.29
N$8
  Top 0.203: C7.1 R4.2
N$9
  Top 0.203: 29.21,13.31 IC2.7 28.45,13.31 26.96,11.82 26.96,11.76 C5.2 R5.1 C6.1
N$10
  Top 0.203: LED1.C 13.97,8.08 14.63,8.74 14.63,9.29 R18.1
N$11
  Top 0.203: C10.2 39.75,22.61 40.64,23.5 40.64,24.85 D3.2
N$12
  Top 0.203: C11.2 33.02,21.17 33.02,20.32 33.66,19.68 34.76,19.68 IC2.13 35.61,19.66 36.58,18.69 38.81,18.69 39.22,19.1 39.22,19.57 R8.2 C9.1
N$13
  Top 0.203: C11.1 R7.2
N$14
  Top 0.203: C9.2 R8.1 | C9.2 C10.1 | IC2.14 35.53,20.93 35.56,20.95 37.4,20.95 C9.2
N$15
  Top 0.203: IC3.8 10.89,15.04 8.74,15.04 7.92,15.85 5.71,15.85 | 5.71,15.85 2.52,15.85 1.91,15.24 1.61,15.24 C18.2 | Y1.1 5.65,15.78 5.71,15.85
N$16
  Top 0.203: LED2.C 15.47,7.95 16.05,8.53 16.05,9.29 R19.1
N$17
  Top 0.203: R11.2 C13.2 | R10.1 R11.2 | IC2.3 27.72,18.39 R11.2
N$18
  Top 0.254: U$1.4 12.33,8.91 R20.1
N$19
  Top 0.203: U$7.R 2,23.33 3.05,24.38 6.75,24.38 R15.1
N$20
  Top 0.203: R16.1 6.04,21.18 5.28,21.95 4.69,21.95 U$7.B
N$21
  Top 0.406: 1.91,8.91 U$1.5 | 1.91,8.26 U$1.6 | 1.91,6.99 U$1.7 | 1.91,5.71 U$1.8
  Top 1.27: JP4.2 1.91,5.71 1.91,6.99 1.91,8.26 1.91,8.91
N$22
  Top 0.203: R17.1 5.99,22.66 5.28,23.37 4.71,23.37 U$7.G
R
  Top 0.203: R15.2 11.43,24.13 12.39,23.16 12.39,21.48 IC3.32
RESET  (via drill 0.51)
  Top 0.203: 14.84,26.55 IC3.29 v14.84,20.53 v14.83,20.52 | 14.84,26.55 R13.1 | 14.84,26.55 15.69,26.55 C17.2
  Bottom 0.203: v14.83,20.52 14.83,16.46 17.68,13.61 17.68,8.36 19.05,6.99 19.05,2.9 19.91,2.03 21.13,2.03 J1.5
RX
  Top 0.203: IC3.30 14.04,23.96 11.99,26.01 11.99,27.84 JP5.3
S1
  Top 0.203: S1.1 S1.2 | IC3.27 16.44,24.39 18.36,26.34 28.88,26.34 29.21,26.67 S1.1 | S1.1 27.73,29.21 C26.1
S2
  Top 0.203: IC3.28 15.64,24.53 19.05,27.94 S2.1 S2.2 25.82,29.21 C25.1
SCK  (via drill 0.51)
  Top 0.203: IC3.17 19.53,14.45 19.1,14.02 v19.1,11.38
  Bottom 0.203: v19.1,11.38 19.1,10.11 21.59,7.62 21.59,5.03 J1.3
SERVO  (via drill 0.51)
  Top 0.203: IC3.13 15.64,12.03 v15.6,11.99
  Bottom 0.203: JP2.2 38.1,2.23 38.1,3.17 37.47,3.81 34.29,3.81 31.75,1.27 16.51,1.27 15.6,2.18 v15.6,11.99
SIG0
  Top 0.203: IC2.5 29.6,15.82 31.32,15.82 31.93,15.21 39.4,15.21 JP1.2
SIG1
  Top 0.203: IC2.10 43.79,15.85 JP6.2
SIG2
  Top 0.203: IC2.12 35.87,18.39 36.37,17.88 39.47,17.88 JP7.2
TX
  Top 0.203: IC3.31 13.24,23.54 9.55,27.23 9.55,27.74 JP5.2
V+  (via drill 0.51)
  Top 0.203: 46.35,13.97 46.35,8.89 45.09,7.62 JP1.1 43.18,7.62 42.55,6.99 38.73,6.99 38.1,7.62 38.1,8.06 R1.1 36.17,8.28 35.56,8.89 35.56,10.97 v35.18,11.35 | 46.35,13.97 46.35,18.41 JP7.1 | 46.35,13.97 JP6.1 | IC2.1 IC2.2 30.94,19.66 31.52,19.07 v31.52,18.26 | IC2.1 29.58,21.87 R7.1 | IC2.1 29.55,20.95 28.36,20.95 C14.2 26.89,23.1 26.44,23.55 22.9,23.55 C15.2 22.29,22.14 21.97,21.82 19.33,21.82 18.29,20.78 18.29,17.68 18.59,17.38 IC3.20 | v31.52,14.43 31.11,13.95 28.25,13.95 27.61,13.31 R4.1
  Bottom 0.203: v31.52,18.26 v31.52,14.43 31.52,13.56 32.38,12.7 33.83,12.7 v35.18,11.35
VBAT  (via drill 0.51)
  Top 0.203: R14.2 R12.1 11.11,13.55 v12.8,15.24 | v13.41,19.51 16.05,19.51 17.27,20.73 17.27,22.04 IC3.26
  Bottom 0.203: v12.8,15.24 12.8,18.9 v13.41,19.51
VCC
  Top 0.203: R12.2 9.93,10.57 9.53,10.16 6.35,10.16 4.45,8.26 JP4.1 | 25.53,1.02 25.81,1.02 IC1.3
  Top 1.27: JP4.1 JP3.2 10.79,4.34 C23.1 13.49,4.59 16.87,1.02 25.53,1.02
  Bottom 1.27: 4.42,1.93 10.77,1.93 JP3.2
VREG
  Top 0.508: IC1.2 IC1.4 32.31,3.73 32.31,4.47 32.51,4.67 C24.1 35.02,6.46 L1.1
  Top 0.762: C24.1 35.02,2.11 JP2.3
  pour Top (isolate 0.305, no thermals): 33.32,5.49 29.67,5.49 28.45,4.27 24.99,4.27 24.99,2.24 27.64,2.24 27.64,0.2 33.32,0.2 33.32,2.64 34.34,3.66 34.34,5.49

### Text on the board
tNames: GND | TX | RX | 5V | MOSI | GND | - M + | + | - | + | ~ | - | MISO | SCK | RST | SERVO
bNames: William Breidenthal